# EAGLE schematic dtack-generator (EAGLE 9.2.2)
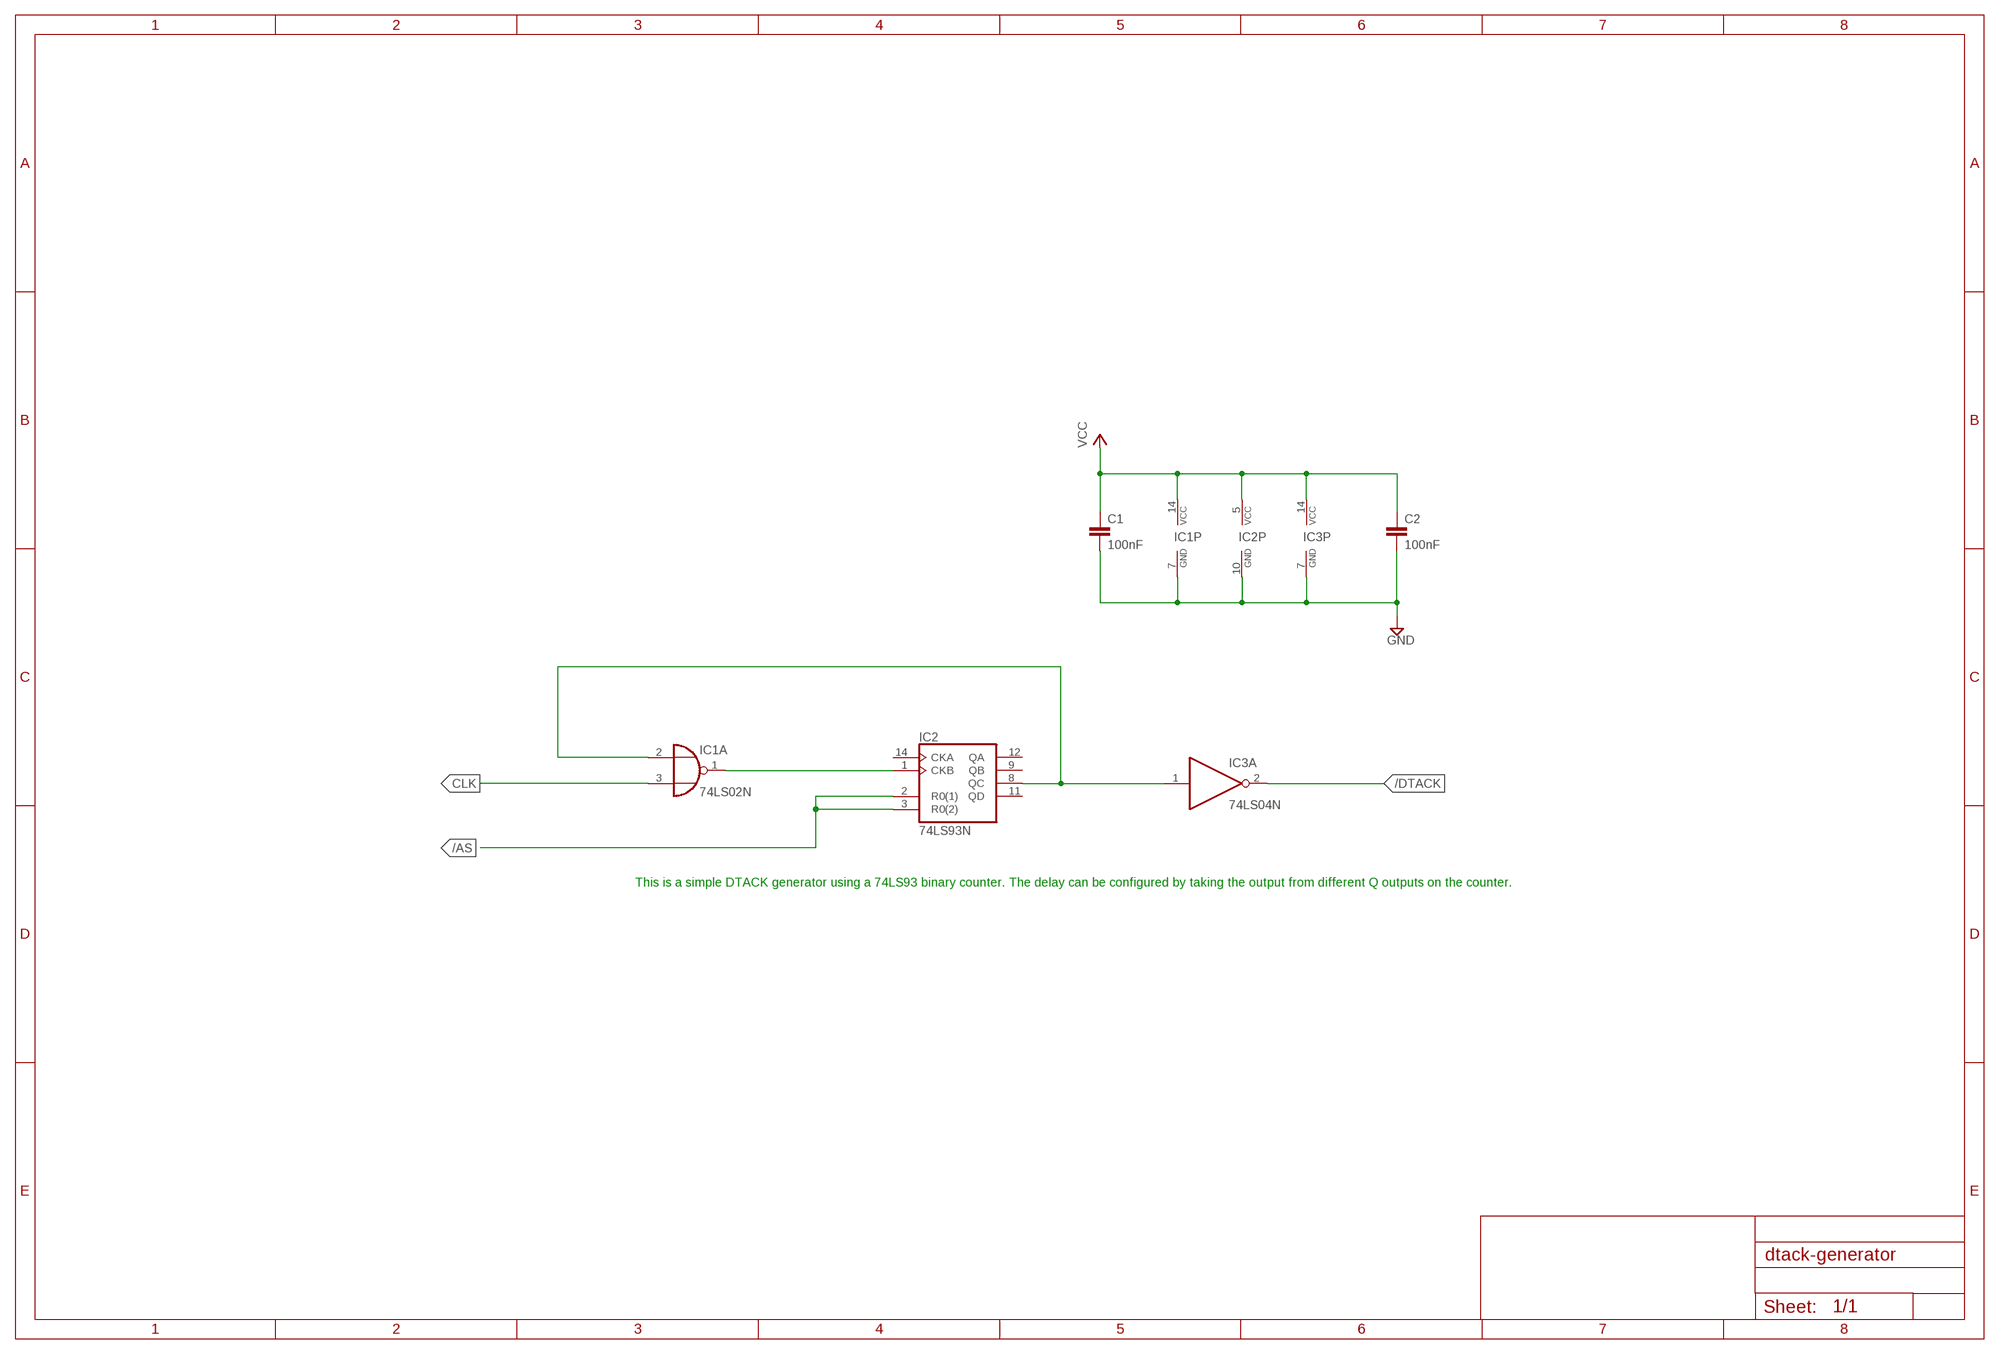
[diagram p0: schematic, sheet 1]

## Parts
C1  100nF  C-EU025-024X044  [C025-024X044]
C2  100nF  C-EU025-024X044  [C025-024X044]
IC1  74LS02N  [DIL14]
IC2  74LS93N  [DIL14]
IC3  74LS04N  [DIL14]

## Nets
/AS: IC2.2(R0(1)) IC2.3(R0(2))
/DTACK: IC3.2(A:O)
CLK: IC1.3(A:I1)
GND: C1.2 C2.2 IC1.7(P:GND) IC2.10(GND) IC3.7(P:GND)
N$1: IC1.1(A:O) IC2.1(CKB)
N$2: IC1.2(A:I0) IC2.8(QC) IC3.1(A:I)
VCC: C1.1 C2.1 IC1.14(P:VCC) IC2.5(VCC) IC3.14(P:VCC)
Unconnected: IC1.4(B:O) IC1.5(B:I0) IC1.6(B:I1) IC1.8(C:I0) IC1.9(C:I1) IC1.10(C:O) IC1.11(D:I0) IC1.12(D:I1) IC1.13(D:O) IC2.9(QB) IC2.11(QD) IC2.12(QA) IC2.14(CKA) IC3.3(B:I) IC3.4(B:O) IC3.5(C:I) IC3.6(C:O) IC3.8(D:O) IC3.9(D:I) IC3.10(E:O) IC3.11(E:I) IC3.12(F:O) IC3.13(F:I)

## Notes on the sheet
- This is a simple DTACK generator using a 74LS93 binary counter. The delay can be configured by taking the output from different Q outputs on the counter.

## Library data of the parts
C1 C2 = rcl:C-EU: CAPACITOR, European symbol; SPICEPREFIX: C
IC1 = 74xx-eu:74*02: Quad 2-input NOR gate
IC2 = 74xx-eu:74*93: Decade, divide by twelve and binary COUNTER
IC3 = 74xx-eu:74*04: Hex INVERTER